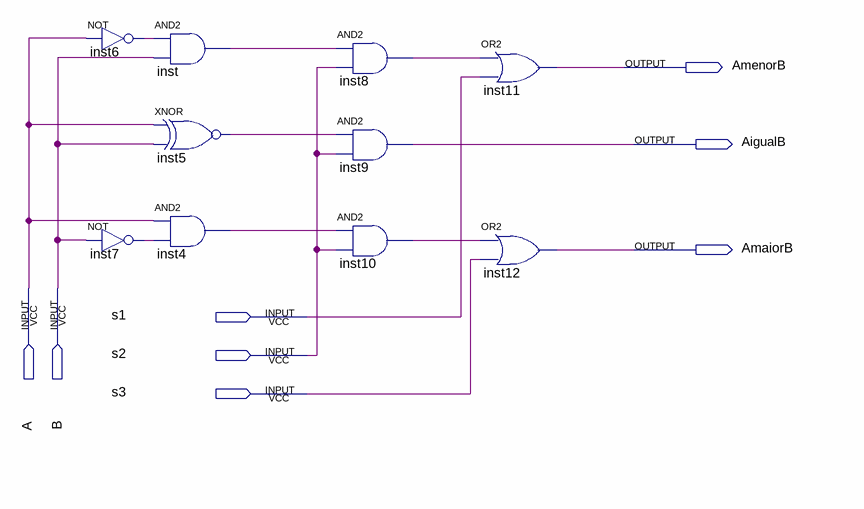
[diagram p0: schematic sheet]
// Quartus schematic projeto.bdf as structural Verilog: 10 symbols, 8 pins
module projeto (
  input  A,
  input  B,
  input  s1,
  input  s2,
  input  s3,
  output AmenorB,
  output AigualB,
  output AmaiorB
);

  wire inst4_out, inst5_out, inst6_out, inst7_out, inst8_out, inst10_out, inst_out;

  not inst6 (inst6_out, A);
  not inst7 (inst7_out, B);
  and inst (inst_out, inst6_out, B);
  xnor inst5 (inst5_out, A, B);
  and inst4 (inst4_out, A, inst7_out);
  and inst8 (inst8_out, inst_out, s2);
  and inst9 (AigualB, inst5_out, s2);
  and inst10 (inst10_out, inst4_out, s2);
  or inst11 (AmenorB, inst8_out, s1);
  or inst12 (AmaiorB, inst10_out, s3);
endmodule
